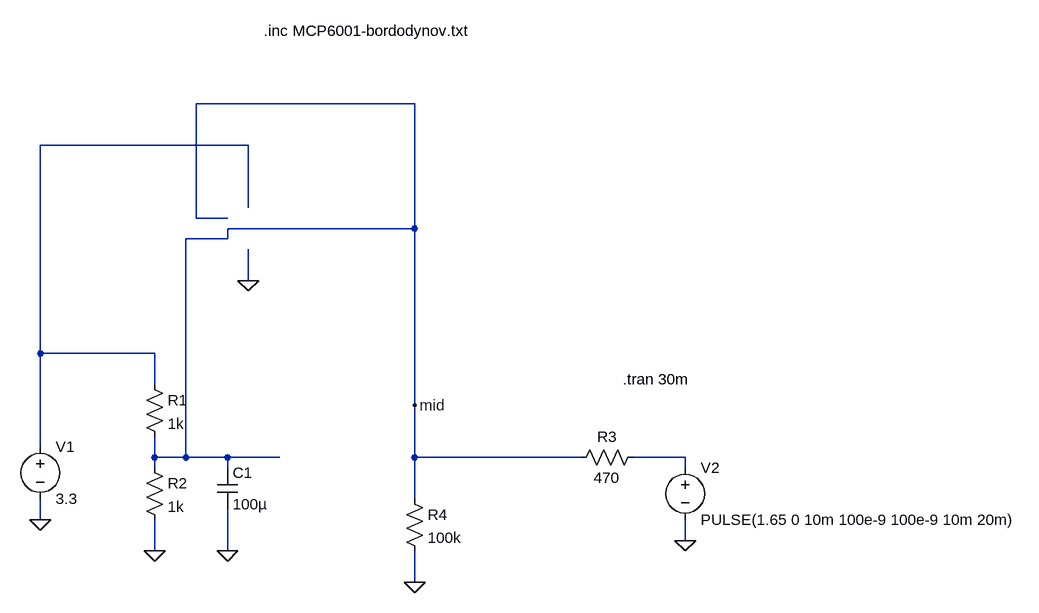
[diagram p0: schematic vdiv_w_cap_loded_pulse_vdrop.asc]
vdiv_w_cap_loded_pulse_vdrop.asc, the LTspice schematic file:
Version 4.1
SHEET 1 1540 680
WIRE 576 -368 240 -368
WIRE 320 -304 0 -304
WIRE 320 -208 320 -304
WIRE 240 -192 240 -368
WIRE 288 -192 240 -192
WIRE 576 -176 576 -368
WIRE 576 -176 288 -176
WIRE 288 -160 288 -176
WIRE 288 -160 224 -160
WIRE 320 -96 320 -144
WIRE 0 16 0 -304
WIRE 176 16 0 16
WIRE 176 64 176 16
WIRE 576 96 576 -176
WIRE 0 160 0 16
WIRE 176 176 176 144
WIRE 224 176 224 -160
WIRE 224 176 176 176
WIRE 288 176 224 176
WIRE 368 176 288 176
WIRE 576 176 576 96
WIRE 832 176 576 176
WIRE 992 176 912 176
WIRE 176 192 176 176
WIRE 288 192 288 176
WIRE 992 192 992 176
WIRE 576 240 576 176
WIRE 0 272 0 240
WIRE 992 304 992 272
WIRE 176 320 176 272
WIRE 288 320 288 256
WIRE 576 368 576 320
FLAG 176 320 0
FLAG 288 320 0
FLAG 0 272 0
FLAG 992 304 0
FLAG 320 -96 0
FLAG 576 368 0
FLAG 576 96 mid
SYMBOL res 160 48 R0
SYMATTR InstName R1
SYMATTR Value 1k
SYMBOL res 160 176 R0
SYMATTR InstName R2
SYMATTR Value 1k
SYMBOL cap 272 192 R0
SYMATTR InstName C1
SYMATTR Value 100µ
SYMBOL voltage 0 144 R0
WINDOW 123 0 0 Left 0
WINDOW 39 0 0 Left 0
SYMATTR InstName V1
SYMATTR Value 3.3
SYMBOL res 928 160 R90
WINDOW 0 0 56 VBottom 2
WINDOW 3 32 56 VTop 2
SYMATTR InstName R3
SYMATTR Value 470
SYMBOL voltage 992 176 R0
WINDOW 123 0 0 Left 0
WINDOW 39 0 0 Left 0
SYMATTR InstName V2
SYMATTR Value PULSE(1.65 0 10m 100e-9 100e-9 10m 20m)
SYMBOL res 560 224 R0
SYMATTR InstName R4
SYMATTR Value 100k
TEXT 896 56 Left 2 !.tran 30m
TEXT 344 -480 Left 2 !.inc MCP6001-bordodynov.txt

The netlist it stands for:
* vdiv_w_cap_loded_pulse_vdrop.asc
R1 N001 mid 1k
R2 mid 0 1k
C1 mid 0 100µ
V1 N001 0 3.3
R3 N002 mid 470
V2 N002 0 PULSE(1.65 0 10m 100e-9 100e-9 10m 20m)
R4 mid 0 100k
.tran 30m
.inc MCP6001-bordodynov.txt
.backanno
.end